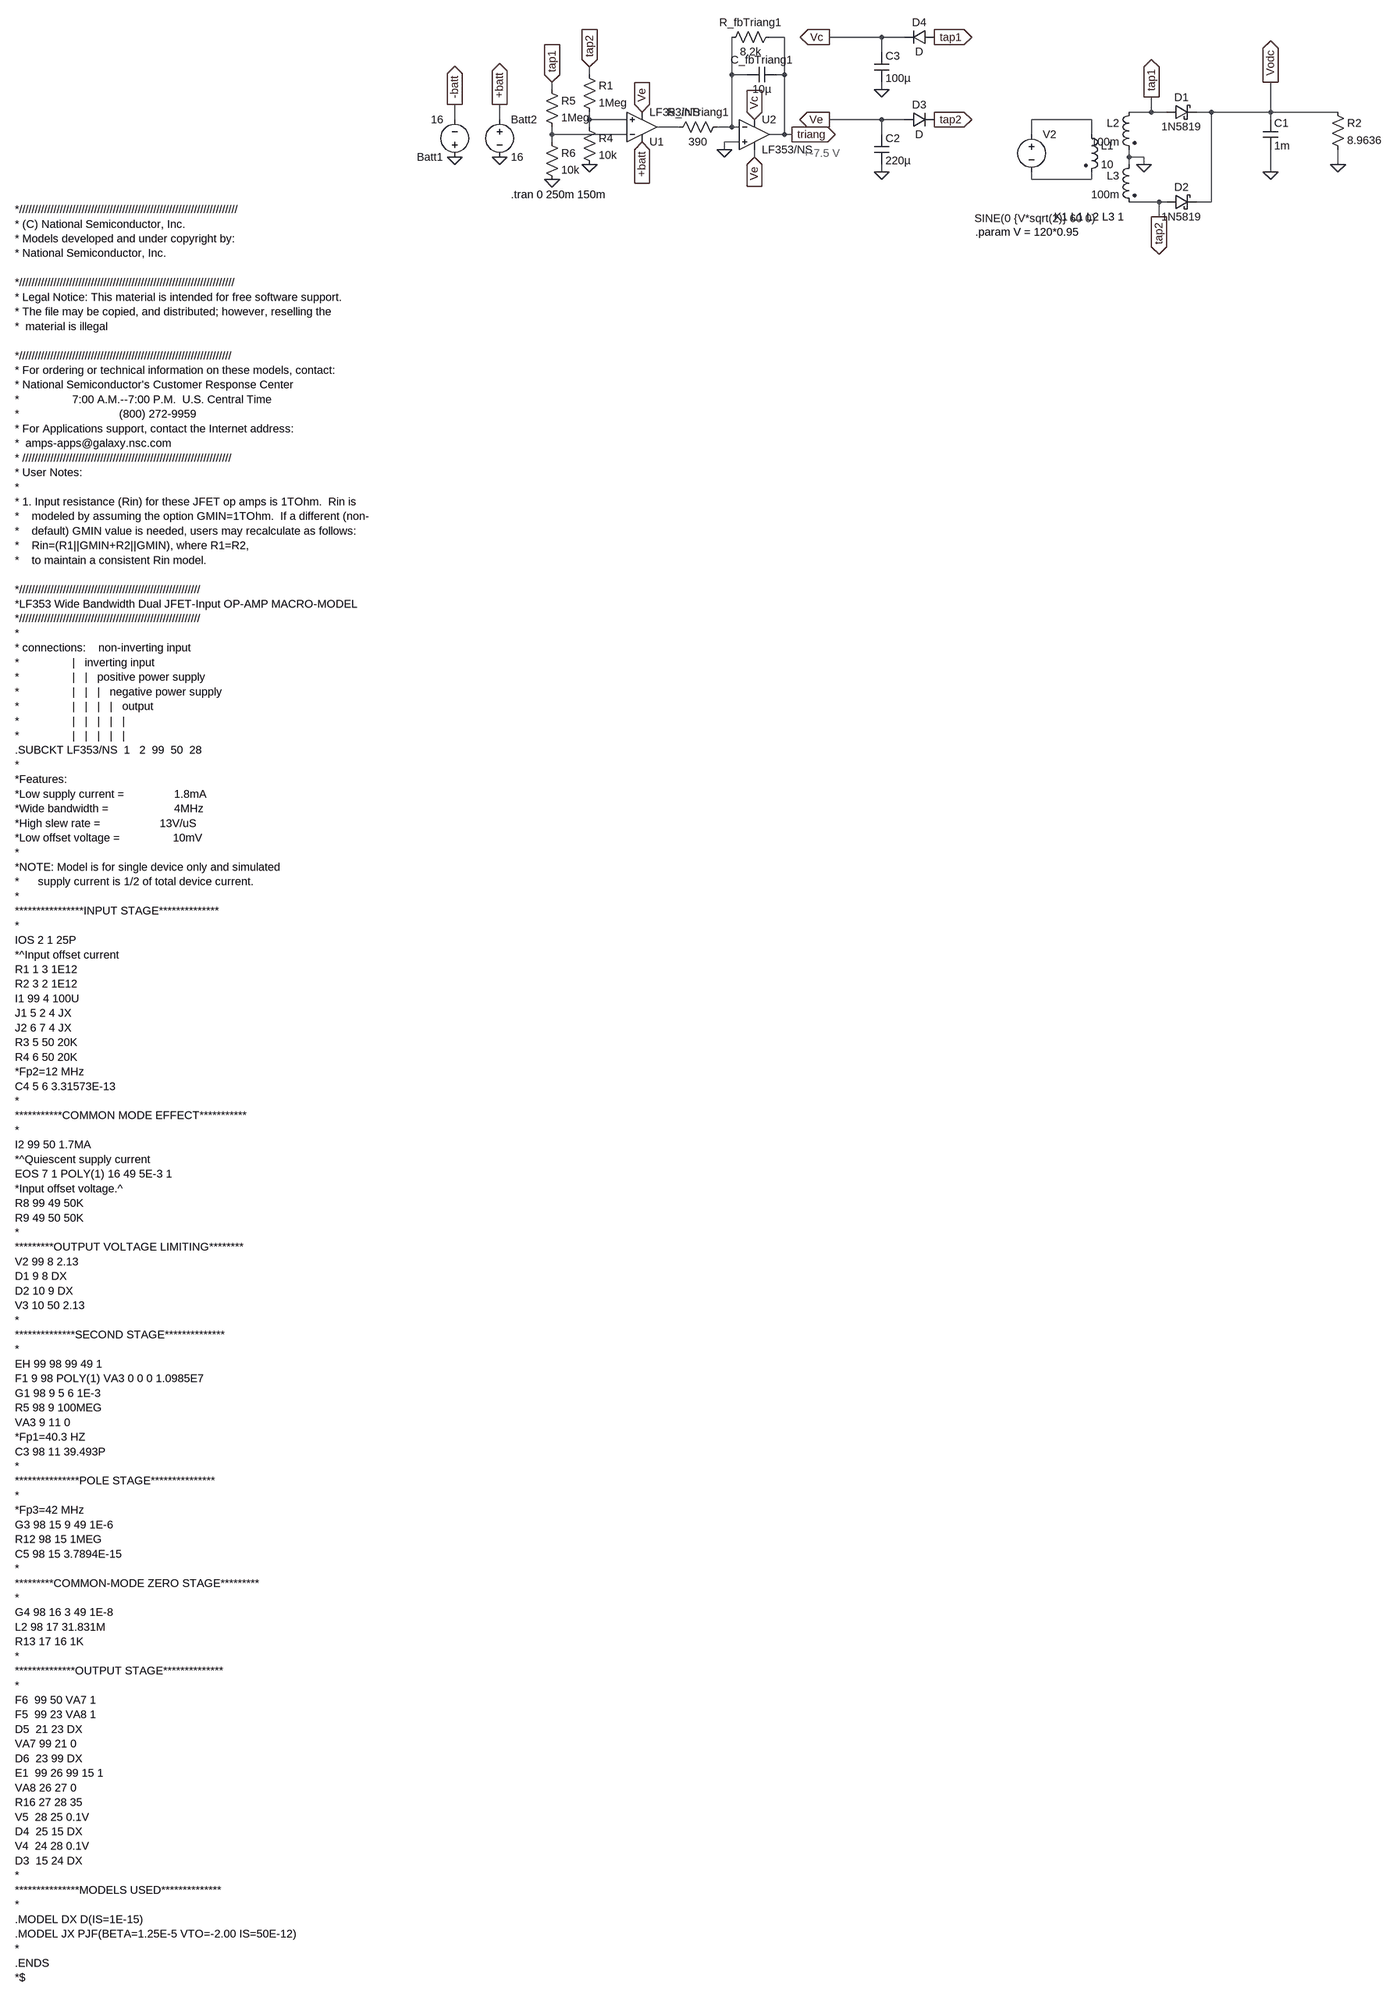
[diagram p0: schematic SupplyOpAmps.asc]
SupplyOpAmps.asc, the LTspice schematic file:
Version 4
SHEET 1 1396 2592
WIRE 144 32 112 32
WIRE 352 32 240 32
WIRE 400 32 352 32
WIRE 352 64 352 32
WIRE -272 112 -272 96
WIRE 32 112 32 32
WIRE 64 112 32 112
WIRE 144 112 144 32
WIRE 144 112 128 112
WIRE -352 144 -352 128
WIRE 352 144 352 128
WIRE 928 192 928 160
WIRE 928 192 880 192
WIRE 960 192 928 192
WIRE 1056 192 1024 192
WIRE 1184 192 1184 128
WIRE 1184 192 1056 192
WIRE 1328 192 1184 192
WIRE -560 208 -560 176
WIRE -464 208 -464 176
WIRE -272 208 -272 192
WIRE -192 208 -272 208
WIRE 352 208 240 208
WIRE 400 208 352 208
WIRE 800 208 672 208
WIRE 1184 208 1184 192
WIRE -272 224 -272 208
WIRE -80 224 -128 224
WIRE 32 224 32 112
WIRE 32 224 0 224
WIRE 48 224 32 224
WIRE -352 240 -352 224
WIRE -192 240 -352 240
WIRE 144 240 144 112
WIRE 144 240 112 240
WIRE 160 240 144 240
WIRE 352 240 352 208
WIRE 672 240 672 208
WIRE 800 240 800 208
WIRE -352 256 -352 240
WIRE 48 256 16 256
WIRE 16 272 16 256
WIRE 80 288 80 272
WIRE 880 288 880 272
WIRE 912 288 880 288
WIRE 880 304 880 288
WIRE 912 304 912 288
WIRE 1328 304 1328 272
WIRE 352 320 352 304
WIRE 1184 320 1184 272
WIRE 672 336 672 320
WIRE 800 336 800 320
WIRE 800 336 672 336
WIRE 944 384 880 384
WIRE 960 384 944 384
WIRE 1056 384 1056 192
WIRE 1056 384 1024 384
WIRE 944 416 944 384
FLAG 1184 320 0
FLAG 1184 128 Vodc
IOPIN 1184 128 Out
FLAG 1328 304 0
FLAG 912 304 0
FLAG 928 160 tap1
IOPIN 928 160 Out
FLAG 944 416 tap2
IOPIN 944 416 Out
FLAG 464 208 tap2
IOPIN 464 208 Out
FLAG 240 208 Ve
IOPIN 240 208 Out
FLAG 352 320 0
FLAG 464 32 tap1
IOPIN 464 32 Out
FLAG 240 32 Vc
IOPIN 240 32 Out
FLAG 352 144 0
FLAG -272 96 tap2
IOPIN -272 96 In
FLAG -160 256 +batt
IOPIN -160 256 In
FLAG -560 288 0
FLAG -464 176 +batt
IOPIN -464 176 Out
FLAG -464 288 0
FLAG -560 176 -batt
IOPIN -560 176 Out
FLAG -272 304 0
FLAG -352 128 tap1
IOPIN -352 128 In
FLAG -352 336 0
FLAG -160 192 Ve
IOPIN -160 192 In
FLAG 16 272 0
FLAG 80 288 Ve
IOPIN 80 288 In
FLAG 160 240 triang
IOPIN 160 240 Out
FLAG 80 208 Vc
IOPIN 80 208 In
SYMBOL voltage 672 224 R0
WINDOW 3 -122 195 Left 2
WINDOW 123 0 0 Left 0
WINDOW 39 0 0 Left 0
SYMATTR Value SINE(0 {V*sqrt(2)} 60 0)
SYMATTR InstName V2
SYMBOL schottky 960 208 R270
WINDOW 0 32 32 VTop 2
WINDOW 3 0 32 VBottom 2
SYMATTR InstName D1
SYMATTR Value 1N5819
SYMATTR Description Diode
SYMATTR Type diode
SYMBOL cap 1168 208 R0
SYMATTR InstName C1
SYMATTR Value 1m
SYMBOL res 1312 176 R0
SYMATTR InstName R2
SYMATTR Value 8.9636
SYMBOL ind2 784 224 R0
SYMATTR InstName L1
SYMATTR Value 10
SYMATTR Type ind
SYMATTR SpiceLine Rser=1m
SYMBOL ind2 896 176 M0
SYMATTR InstName L2
SYMATTR Value 100m
SYMATTR Type ind
SYMATTR SpiceLine Rser=1m
SYMBOL ind2 896 288 M0
SYMATTR InstName L3
SYMATTR Value 100m
SYMATTR Type ind
SYMATTR SpiceLine Rser=1m
SYMBOL schottky 960 400 R270
WINDOW 0 32 32 VTop 2
WINDOW 3 0 32 VBottom 2
SYMATTR InstName D2
SYMATTR Value 1N5819
SYMATTR Description Diode
SYMATTR Type diode
SYMBOL cap 336 240 R0
SYMATTR InstName C2
SYMATTR Value 220µ
SYMBOL cap 336 64 R0
SYMATTR InstName C3
SYMATTR Value 100µ
SYMBOL res -288 96 R0
SYMATTR InstName R1
SYMATTR Value 1Meg
SYMBOL res -288 208 R0
SYMATTR InstName R4
SYMATTR Value 10k
SYMBOL voltage -560 304 R180
WINDOW 123 0 0 Left 0
WINDOW 39 0 0 Left 0
SYMATTR InstName Batt1
SYMATTR Value 16
SYMBOL voltage -464 192 R0
WINDOW 123 0 0 Left 0
WINDOW 39 0 0 Left 0
SYMATTR InstName Batt2
SYMATTR Value 16
SYMBOL res -368 128 R0
SYMATTR InstName R5
SYMATTR Value 1Meg
SYMBOL OpAmps\\opamp2 -160 288 M180
SYMATTR InstName U1
SYMATTR Value LF353/NS
SYMBOL res -368 240 R0
SYMATTR InstName R6
SYMATTR Value 10k
SYMBOL diode 464 16 R90
WINDOW 0 0 32 VBottom 2
WINDOW 3 32 32 VTop 2
SYMATTR InstName D4
SYMBOL diode 400 224 R270
WINDOW 0 32 32 VTop 2
WINDOW 3 0 32 VBottom 2
SYMATTR InstName D3
SYMBOL res -96 240 R270
WINDOW 0 32 56 VTop 2
WINDOW 3 0 56 VBottom 2
SYMATTR InstName R_inTriang1
SYMATTR Value 390
SYMBOL cap 64 128 R270
WINDOW 0 32 32 VTop 2
WINDOW 3 0 32 VBottom 2
SYMATTR InstName C_fbTriang1
SYMATTR Value 10µ
SYMATTR SpiceLine Rser=20m
SYMBOL res 16 48 R270
WINDOW 0 32 56 VTop 2
WINDOW 3 0 56 VBottom 2
SYMATTR InstName R_fbTriang1
SYMATTR Value 8.2k
SYMBOL OpAmps\\opamp2 80 176 R0
SYMATTR InstName U2
SYMATTR Value LF353/NS
TEXT 720 416 Left 2 !K1 L1 L2 L3 1
TEXT 552 448 Left 2 !.param V = 120*0.95
TEXT -440 368 Left 2 !.tran 0 250m 150m
TEXT -1664 400 Left 2 !*//////////////////////////////////////////////////////////////////////\n* (C) National Semiconductor, Inc.\n* Models developed and under copyright by:\n* National Semiconductor, Inc.  \n \n*/////////////////////////////////////////////////////////////////////\n* Legal Notice: This material is intended for free software support.\n* The file may be copied, and distributed; however, reselling the \n*  material is illegal\n \n*////////////////////////////////////////////////////////////////////\n* For ordering or technical information on these models, contact:\n* National Semiconductor's Customer Response Center\n*                 7:00 A.M.--7:00 P.M.  U.S. Central Time\n*                                (800) 272-9959\n* For Applications support, contact the Internet address:\n*  amps-apps@galaxy.nsc.com\n* ///////////////////////////////////////////////////////////////////\n* User Notes:\n*\n* 1. Input resistance (Rin) for these JFET op amps is 1TOhm.  Rin is\n*    modeled by assuming the option GMIN=1TOhm.  If a different (non-\n*    default) GMIN value is needed, users may recalculate as follows:\n*    Rin=(R1||GMIN+R2||GMIN), where R1=R2,\n*    to maintain a consistent Rin model.\n \n*//////////////////////////////////////////////////////////\n*LF353 Wide Bandwidth Dual JFET-Input OP-AMP MACRO-MODEL\n*//////////////////////////////////////////////////////////\n*\n* connections:    non-inverting input\n*                 |   inverting input\n*                 |   |   positive power supply\n*                 |   |   |   negative power supply\n*                 |   |   |   |   output\n*                 |   |   |   |   |\n*                 |   |   |   |   |\n.SUBCKT LF353/NS  1   2  99  50  28\n*\n*Features:\n*Low supply current =                1.8mA\n*Wide bandwidth =                     4MHz\n*High slew rate =                   13V/uS\n*Low offset voltage =                 10mV\n*\n*NOTE: Model is for single device only and simulated\n*      supply current is 1/2 of total device current.\n*\n****************INPUT STAGE************** \n*\nIOS 2 1 25P\n*^Input offset current\nR1 1 3 1E12\nR2 3 2 1E12\nI1 99 4 100U\nJ1 5 2 4 JX\nJ2 6 7 4 JX\nR3 5 50 20K\nR4 6 50 20K\n*Fp2=12 MHz\nC4 5 6 3.31573E-13\n*\n***********COMMON MODE EFFECT***********\n*\nI2 99 50 1.7MA\n*^Quiescent supply current\nEOS 7 1 POLY(1) 16 49 5E-3 1\n*Input offset voltage.^\nR8 99 49 50K\nR9 49 50 50K\n*\n*********OUTPUT VOLTAGE LIMITING********\nV2 99 8 2.13\nD1 9 8 DX\nD2 10 9 DX\nV3 10 50 2.13\n*\n**************SECOND STAGE**************\n*\nEH 99 98 99 49 1\nF1 9 98 POLY(1) VA3 0 0 0 1.0985E7\nG1 98 9 5 6 1E-3\nR5 98 9 100MEG\nVA3 9 11 0\n*Fp1=40.3 HZ\nC3 98 11 39.493P\n*\n***************POLE STAGE***************\n*\n*Fp3=42 MHz\nG3 98 15 9 49 1E-6\nR12 98 15 1MEG\nC5 98 15 3.7894E-15\n*\n*********COMMON-MODE ZERO STAGE*********\n*\nG4 98 16 3 49 1E-8\nL2 98 17 31.831M\nR13 17 16 1K\n*\n**************OUTPUT STAGE**************\n*\nF6  99 50 VA7 1\nF5  99 23 VA8 1\nD5  21 23 DX\nVA7 99 21 0\nD6  23 99 DX\nE1  99 26 99 15 1\nVA8 26 27 0\nR16 27 28 35\nV5  28 25 0.1V\nD4  25 15 DX\nV4  24 28 0.1V\nD3  15 24 DX\n*\n***************MODELS USED**************\n*\n.MODEL DX D(IS=1E-15)\n.MODEL JX PJF(BETA=1.25E-5 VTO=-2.00 IS=50E-12)\n*\n.ENDS\n*$
TEXT 184 280 Left 2 ;+-7.5 V

The netlist it stands for:
* SupplyOpAmps.asc
V2 N003 N006 SINE(0 {V*sqrt(2)} 60 0)
D1 tap1 Vodc 1N5819
C1 Vodc 0 1m
R2 Vodc 0 8.9636
L1 N003 N006 10 Rser=1m
L2 tap1 0 100m Rser=1m
L3 0 tap2 100m Rser=1m
D2 tap2 Vodc 1N5819
C2 Ve 0 220µ
C3 Vc 0 100µ
R1 tap2 N002 1Meg
R4 N002 0 10k
V§Batt1 0 -batt 16
V§Batt2 +batt 0 16
R5 tap1 N005 1Meg
XU1 N002 N005 +batt Ve N004 LF353/NS  ; pins In+ In- V+ V- OUT
R6 N005 0 10k
D4 tap1 Vc D
D3 Ve tap2 D
R_inTriang1 N004 N001 390
C_fbTriang1 N001 triang 10µ Rser=20m
R_fbTriang1 N001 triang 8.2k
XU2 0 N001 Vc Ve triang LF353/NS  ; pins In+ In- V+ V- OUT
.model D D
.lib standard.dio
K1 L1 L2 L3 1
.param V = 120*0.95
.tran 0 250m 150m
*//////////////////////////////////////////////////////////////////////
* (C) National Semiconductor, Inc.
* Models developed and under copyright by:
* National Semiconductor, Inc.
*/////////////////////////////////////////////////////////////////////
* Legal Notice: This material is intended for free software support.
* The file may be copied, and distributed; however, reselling the
*  material is illegal
*////////////////////////////////////////////////////////////////////
* For ordering or technical information on these models, contact:
* National Semiconductor's Customer Response Center
*                 7:00 A.M.--7:00 P.M.  U.S. Central Time
*                                (800) 272-9959
* For Applications support, contact the Internet address:
*  amps-apps@galaxy.nsc.com
* ///////////////////////////////////////////////////////////////////
* User Notes:
*
* 1. Input resistance (Rin) for these JFET op amps is 1TOhm.  Rin is
*    modeled by assuming the option GMIN=1TOhm.  If a different (non-
*    default) GMIN value is needed, users may recalculate as follows:
*    Rin=(R1||GMIN+R2||GMIN), where R1=R2,
*    to maintain a consistent Rin model.
*//////////////////////////////////////////////////////////
*LF353 Wide Bandwidth Dual JFET-Input OP-AMP MACRO-MODEL
*//////////////////////////////////////////////////////////
*
* connections:    non-inverting input
*                 |   inverting input
*                 |   |   positive power supply
*                 |   |   |   negative power supply
*                 |   |   |   |   output
*                 |   |   |   |   |
*                 |   |   |   |   |
.SUBCKT LF353/NS  1   2  99  50  28
*
*Features:
*Low supply current =                1.8mA
*Wide bandwidth =                     4MHz
*High slew rate =                   13V/uS
*Low offset voltage =                 10mV
*
*NOTE: Model is for single device only and simulated
*      supply current is 1/2 of total device current.
*
****************INPUT STAGE**************
*
IOS 2 1 25P
*^Input offset current
R1 1 3 1E12
R2 3 2 1E12
I1 99 4 100U
J1 5 2 4 JX
J2 6 7 4 JX
R3 5 50 20K
R4 6 50 20K
*Fp2=12 MHz
C4 5 6 3.31573E-13
*
***********COMMON MODE EFFECT***********
*
I2 99 50 1.7MA
*^Quiescent supply current
EOS 7 1 POLY(1) 16 49 5E-3 1
*Input offset voltage.^
R8 99 49 50K
R9 49 50 50K
*
*********OUTPUT VOLTAGE LIMITING********
V2 99 8 2.13
D1 9 8 DX
D2 10 9 DX
V3 10 50 2.13
*
**************SECOND STAGE**************
*
EH 99 98 99 49 1
F1 9 98 POLY(1) VA3 0 0 0 1.0985E7
G1 98 9 5 6 1E-3
R5 98 9 100MEG
VA3 9 11 0
*Fp1=40.3 HZ
C3 98 11 39.493P
*
***************POLE STAGE***************
*
*Fp3=42 MHz
G3 98 15 9 49 1E-6
R12 98 15 1MEG
C5 98 15 3.7894E-15
*
*********COMMON-MODE ZERO STAGE*********
*
G4 98 16 3 49 1E-8
L2 98 17 31.831M
R13 17 16 1K
*
**************OUTPUT STAGE**************
*
F6  99 50 VA7 1
F5  99 23 VA8 1
D5  21 23 DX
VA7 99 21 0
D6  23 99 DX
E1  99 26 99 15 1
VA8 26 27 0
R16 27 28 35
V5  28 25 0.1V
D4  25 15 DX
V4  24 28 0.1V
D3  15 24 DX
*
***************MODELS USED**************
*
.MODEL DX D(IS=1E-15)
.MODEL JX PJF(BETA=1.25E-5 VTO=-2.00 IS=50E-12)
*
.ENDS
*$
* +-7.5 V
.backanno
.end